# EAGLE schematic Schematic_v8 (EAGLE 9.7.0)
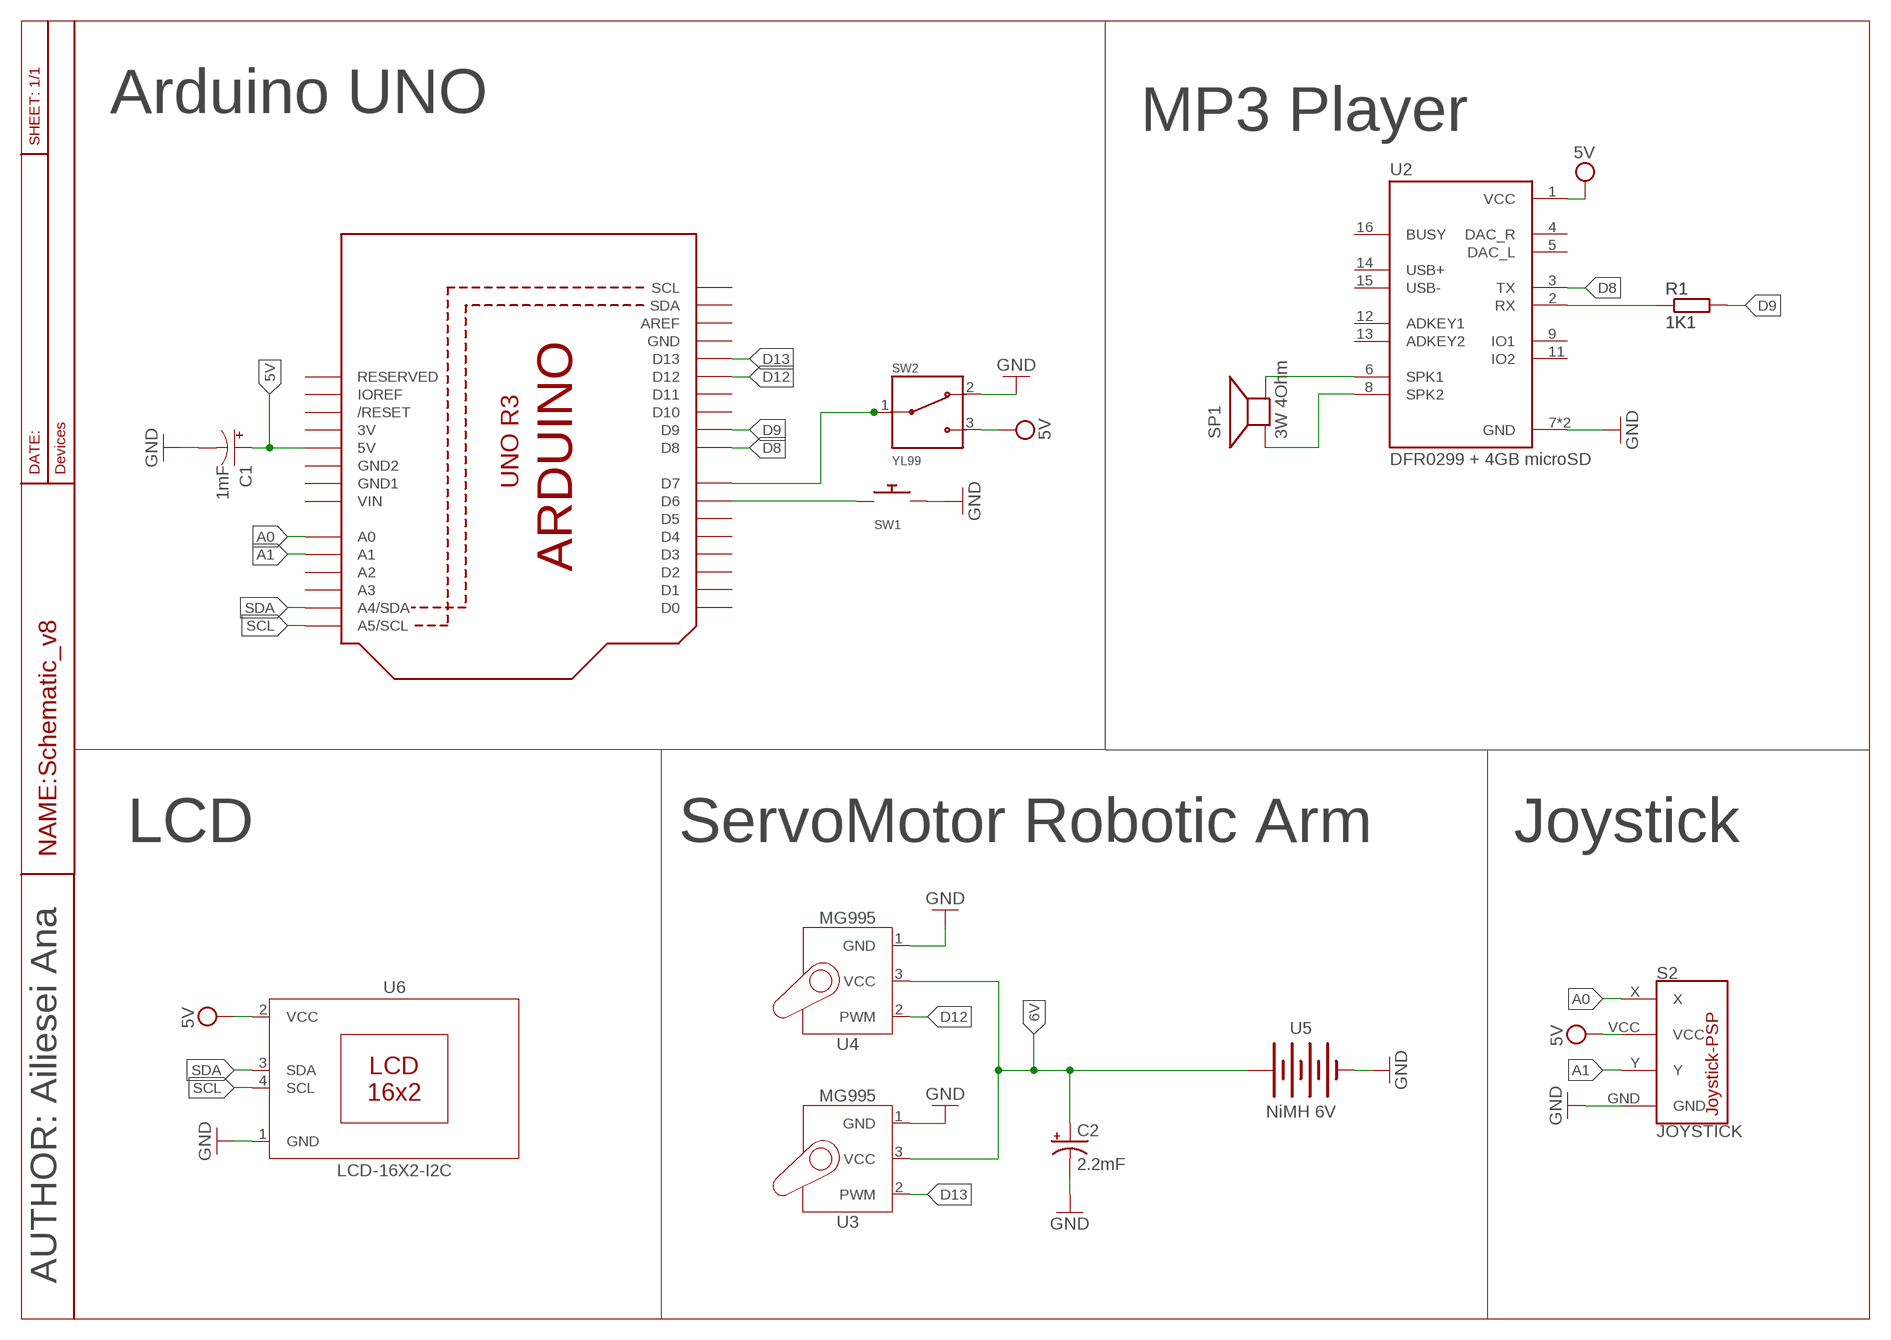
[diagram p0: schematic, sheet 1]

## Parts
C1  1mF  C-POL-US_TANTALUM-1206(3216-METRIC)  [CAPMP3216X180N]
C2  2.2mF  1000UF-RADIAL-5MM-25V-20%  [CPOL-RADIAL-5MM-10MM]
R1  1K1  ESP32_WROVER_EAGLE-LTSPICE_R  [ESP32_WROVER_EAGLE-LTSPICE_R0402]
S2  JOYSTICK  JOYSTICK_SLIDE  [JOYSTICK-PSP1000]
SP1  3W 4Ohm  SPEAKER/AL60P  [AL60P]
SW1  SWITCH_PUSHBUTTONSOFTTOUCHSMD_SJ  [PUSHBUTTON_SMD_SJ]
SW2  YL99  MS0850502F030P1A  [SW_MS0850502F030P1A]
U2  DFR0299 + 4GB microSD  DFR0299  [MODULE_DFR0299]
U3  MG995  SERVOSG90-HDR  [1X03]
U4  MG995  SERVOSG90-HDR  [1X03]
U5  NiMH 6V  BATTERY-6VGENERIC  [BATTERY-GENERIC]
U6  LCD-16X2-I2C  LCD-16X2-I2CSUNFOUNDER-IIC  [LCD-I2C]
U7  ARDUINOR3-DIMENSION  [ARDUINOR3]

## Nets
5V: C1.1(+) S2.VCC SW2.3(NO) U2.1(VCC) U6.2(VCC) U7.5V
6V: C2.+ U3.3(VCC) U4.3(VCC) U5.+
A0: S2.X U7.A0
A1: S2.Y U7.A1
D8: U2.3(TX) U7.D8
D9: R1.2 U7.D9
D11: R1.1 U2.2(RX)
D12: U4.2(PWM) U7.D12
D13: U3.2(PWM) U7.D13
GND: C1.2(-) C2.- S2.GND SW1.P$2 SW2.2(NC) U2.7(GND) U2.10(GND) U3.1(GND) U4.1(GND) U5.- U6.1(GND)
N$1: SP1.2(-) U2.6(SPK1)
N$2: SP1.1(+) U2.8(SPK2)
N$3: SW1.P$1 U7.D6
N$5: SW2.1(COM) U7.D7
SCL: U6.4(SCL) U7.A5(A5/SCL)
SDA: U6.3(SDA) U7.A4(A4/SDA)
Unconnected: U2.4(DAC_R) U2.5(DAC_L) U2.9(IO1) U2.11(IO2) U2.12(ADKEY1) U2.13(ADKEY2) U2.14(USB+) U2.15(USB-) U2.16(BUSY) U7.A2 U7.A3 U7.AREF U7.D0 U7.D1 U7.D2 U7.D3 U7.D4 U7.D5 U7.D10 U7.D11 U7.IOREF U7.RESERVED U7.RESET(/RESET) U7.SCL U7.SDA

## Notes on the sheet
- Arduino UNO | MP3 Player
- LCD | ServoMotor Robotic Arm | Joystick
- AUTHOR: Ailiesei Ana

## Power pins joined to a net without a drawn wire
3V: U7.3V
GND: U7.GND
GND1: U7.GND1
GND2: U7.GND2
VIN: U7.VIN

## Library data of the parts
C1 = Capacitor:C-POL-US: Capacitor Polarised - ANSI; CATEGORY: Capacitor; PACKAGE_SIZE: 1206; PACKAGE_TYPE: SMD; SUBCATEGORY: Tantalum Capacitors; TYPE: Polymer Capacitors
C2 = SparkFun-Capacitors:1000UF: 1,000µF/1mF ceramic capacitors A capacitor is a passive two-terminal electrical component used to store electrical energy temporarily in an electric field. CAP-08070; PROD_ID: CAP-09538; VALUE: 1mF
R1 = DeskAssistant v19 v1:ESP32_WROVER_EAGLE-LTSPICE_R: RESISTOR, European symbol
S2 = SparkFun-Switches:JOYSTICK_SLIDE: Resistive Thumb Slide Joystick This is a resistive analog joystick, very similar to those found on the PSP1000. These compact joysticks are different in that they have a very interesting ‘slide’ feeling. SparkFun Products Thumb Slide Joystick <https://www.sparkfun.com/products/9426> (COM-09426); SF_SKU: COM-09426
SP1 = adafruit:SPEAKER: SPEAKER Source: Buerklin Added PS12 (for part # PS1240 piezo) http://www.ladyada.net/library/pcb/eaglelibrary.html
SW1 = adafruit:SWITCH_PUSHBUTTON: Buttons SOFTTOUCHSMD_SJ - Soft touch temporary push button (Super Junk Akihabara) Compatible with SKPMANE010 [Mouser: 688-SKPMAN] C&K_KSS = Digikey: KSS221GLFS
SW2 = MS0850502F030P1A:MS0850502F030P1A: Check availability <https://pricing.snapeda.com/parts/MS0850502F030P1A/E-Switch/view-part?ref=eda>; AVAILABILITY: In Stock; CHECK_PRICES: https://www.snapeda.com/parts/MS0850502F030P1A/E-Switch/view-part/?ref=eda; DESCRIPTION: Snap Action Switch, SPDT, ON-MOM, MS Series, Straight Lever, 5A, 125VAC, PC Pin | E-Switch MS0850502F030P1A; MF: E-Switch; MP: MS0850502F030P1A; PACKAGE: None; PRICE: None; SNAPEDA_LINK: https://www.snapeda.com/parts/MS0850502F030P1A/E-Switch/view-part/?ref=snap
U2 = DFR0299:DFR0299: Check availability <https://pricing.snapeda.com/parts/DFR0299/DFRobot/view-part?ref=eda>; AVAILABILITY: In Stock; CHECK_PRICES: https://www.snapeda.com/parts/DFR0299/DFRobot/view-part/?ref=eda; DESCRIPTION: - MP3 Player Audio Arduino Platform Evaluation Expansion Board; MF: DFRobot; MP: DFR0299; PACKAGE: None; PRICE: None; SNAPEDA_LINK: https://www.snapeda.com/parts/DFR0299/DFRobot/view-part/?ref=snap
U3 U4 = Tinkercad:SERVO
U5 = Tinkercad:BATTERY-6V
U6 = Tinkercad:LCD-16X2-I2C
U7 = adafruit:ARDUINOR3: This is a new object for the new Arduino R3 - with extra pins that you may want to use (such as IOref, and duplicated A4/A5